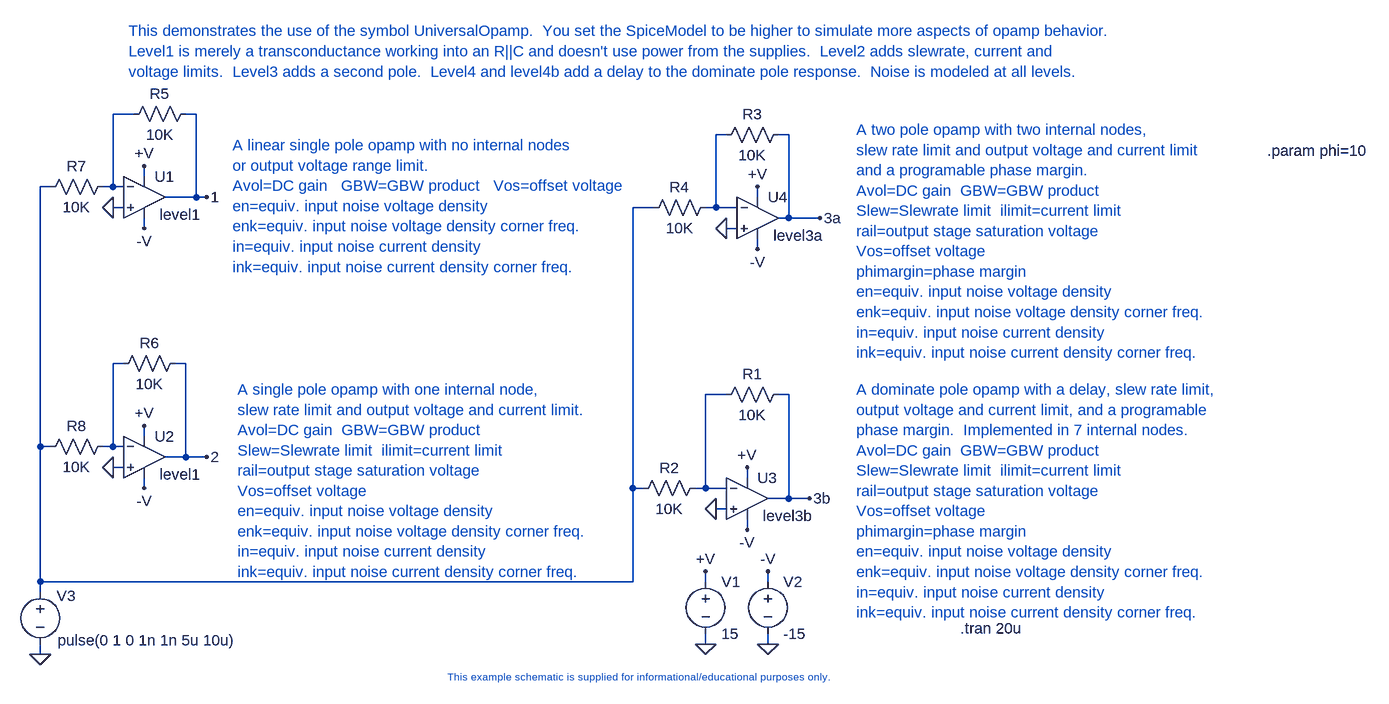
[diagram p0: schematic TimeDomainUniversalOpamp.asc]
TimeDomainUniversalOpamp.asc, the LTspice schematic file:
Version 4
SHEET 1 2580 1112
WIRE 112 -320 80 -320
WIRE 208 -320 192 -320
WIRE 1024 -288 1008 -288
WIRE 1120 -288 1104 -288
WIRE 128 -224 128 -240
WIRE -16 -208 -32 -208
WIRE 80 -208 80 -320
WIRE 80 -208 64 -208
WIRE 96 -208 80 -208
WIRE 208 -192 208 -320
WIRE 208 -192 160 -192
WIRE 224 -192 208 -192
WIRE 1072 -192 1072 -208
WIRE 96 -176 80 -176
WIRE 912 -176 880 -176
WIRE 1008 -176 1008 -288
WIRE 1008 -176 992 -176
WIRE 1040 -176 1008 -176
WIRE 1120 -160 1120 -288
WIRE 1120 -160 1104 -160
WIRE 1168 -160 1120 -160
WIRE 128 -144 128 -160
WIRE 1040 -144 1024 -144
WIRE 1072 -112 1072 -128
WIRE 96 64 80 64
WIRE 192 64 176 64
WIRE 1024 112 992 112
WIRE 1120 112 1104 112
WIRE 128 176 128 160
WIRE -32 192 -32 -208
WIRE -16 192 -32 192
WIRE 80 192 80 64
WIRE 80 192 64 192
WIRE 96 192 80 192
WIRE 192 208 192 64
WIRE 192 208 160 208
WIRE 224 208 192 208
WIRE 96 224 80 224
WIRE 1056 240 1056 224
WIRE 128 256 128 240
WIRE 880 256 880 -176
WIRE 896 256 880 256
WIRE 992 256 992 112
WIRE 992 256 976 256
WIRE 1024 256 992 256
WIRE 1120 272 1120 112
WIRE 1120 272 1088 272
WIRE 1152 272 1120 272
WIRE 1024 288 1008 288
WIRE 1056 320 1056 304
WIRE -32 400 -32 192
WIRE 880 400 880 256
WIRE 880 400 -32 400
WIRE 992 400 992 384
WIRE 1088 400 1088 384
WIRE -32 416 -32 400
WIRE 992 496 992 480
WIRE 1088 496 1088 480
WIRE -32 512 -32 496
FLAG 128 -240 +V
FLAG 128 -144 -V
FLAG 80 -176 0
FLAG 1088 496 0
FLAG 992 496 0
FLAG 992 384 +V
FLAG 1088 384 -V
FLAG -32 512 0
FLAG 128 160 +V
FLAG 128 256 -V
FLAG 80 224 0
FLAG 1056 224 +V
FLAG 1056 320 -V
FLAG 1008 288 0
FLAG 1072 -208 +V
FLAG 1072 -112 -V
FLAG 1024 -144 0
FLAG 224 -192 1
FLAG 224 208 2
FLAG 1152 272 3b
FLAG 1168 -160 3a
SYMBOL voltage 992 384 R0
SYMATTR InstName V1
SYMATTR Value 15
SYMBOL voltage 1088 384 R0
SYMATTR InstName V2
SYMATTR Value -15
SYMBOL voltage -32 400 R0
WINDOW 0 25 22 Left 2
WINDOW 3 27 90 Left 2
SYMATTR InstName V3
SYMATTR Value pulse(0 1 0 1n 1n 5u 10u)
SYMBOL opamps\\UniversalOpamp 128 -192 R0
WINDOW 38 24 27 Left 2
SYMATTR SpiceModel level1
SYMATTR InstName U1
SYMBOL opamps\\UniversalOpamp 128 208 R0
WINDOW 38 24 27 Left 2
SYMATTR InstName U2
SYMATTR SpiceLine ilimit=25m rail=0 Vos=0 phimargin={phi}
SYMBOL opamps\\UniversalOpamp 1056 272 R0
WINDOW 38 24 27 Left 2
SYMATTR SpiceModel level3b
SYMATTR InstName U3
SYMATTR SpiceLine ilimit=25m rail=0 Vos=0 phimargin={phi}
SYMBOL opamps\\UniversalOpamp 1072 -160 R0
WINDOW 38 24 27 Left 2
SYMATTR SpiceModel level3a
SYMATTR InstName U4
SYMATTR SpiceLine ilimit=25m rail=0 Vos=0 phimargin={phi}
SYMBOL res 1120 96 R90
WINDOW 0 0 56 VBottom 2
WINDOW 3 32 56 VTop 2
SYMATTR InstName R1
SYMATTR Value 10K
SYMBOL res 992 240 R90
WINDOW 0 0 56 VBottom 2
WINDOW 3 32 56 VTop 2
SYMATTR InstName R2
SYMATTR Value 10K
SYMBOL res 1120 -304 R90
WINDOW 0 0 56 VBottom 2
WINDOW 3 32 56 VTop 2
SYMATTR InstName R3
SYMATTR Value 10K
SYMBOL res 1008 -192 R90
WINDOW 0 0 56 VBottom 2
WINDOW 3 32 56 VTop 2
SYMATTR InstName R4
SYMATTR Value 10K
SYMBOL res 208 -336 R90
WINDOW 0 0 56 VBottom 2
WINDOW 3 32 56 VTop 2
SYMATTR InstName R5
SYMATTR Value 10K
SYMBOL res 192 48 R90
WINDOW 0 0 56 VBottom 2
WINDOW 3 32 56 VTop 2
SYMATTR InstName R6
SYMATTR Value 10K
SYMBOL res 80 -224 R90
WINDOW 0 0 56 VBottom 2
WINDOW 3 32 56 VTop 2
SYMATTR InstName R7
SYMATTR Value 10K
SYMBOL res 80 176 R90
WINDOW 0 0 56 VBottom 2
WINDOW 3 32 56 VTop 2
SYMATTR InstName R8
SYMATTR Value 10K
TEXT 1384 472 Left 2 !.tran 20u
TEXT 264 -272 Left 2 ;A linear single pole opamp with no internal nodes\nor output voltage range limit.\nAvol=DC gain   GBW=GBW product   Vos=offset voltage\nen=equiv. input noise voltage density\nenk=equiv. input noise voltage density corner freq.\nin=equiv. input noise current density\nink=equiv. input noise current density corner freq.
TEXT 272 104 Left 2 ;A single pole opamp with one internal node,\nslew rate limit and output voltage and current limit.\nAvol=DC gain  GBW=GBW product\nSlew=Slewrate limit  ilimit=current limit\nrail=output stage saturation voltage\nVos=offset voltage\nen=equiv. input noise voltage density\nenk=equiv. input noise voltage density corner freq.\nin=equiv. input noise current density\nink=equiv. input noise current density corner freq.
TEXT 1224 104 Left 2 ;A dominate pole opamp with a delay, slew rate limit,\noutput voltage and current limit, and a programable\nphase margin.  Implemented in 7 internal nodes.\nAvol=DC gain  GBW=GBW product\nSlew=Slewrate limit  ilimit=current limit\nrail=output stage saturation voltage\nVos=offset voltage\nphimargin=phase margin\nen=equiv. input noise voltage density\nenk=equiv. input noise voltage density corner freq.\nin=equiv. input noise current density\nink=equiv. input noise current density corner freq.
TEXT 1224 -296 Left 2 ;A two pole opamp with two internal nodes,\nslew rate limit and output voltage and current limit\nand a programable phase margin.\nAvol=DC gain  GBW=GBW product\nSlew=Slewrate limit  ilimit=current limit\nrail=output stage saturation voltage\nVos=offset voltage\nphimargin=phase margin\nen=equiv. input noise voltage density\nenk=equiv. input noise voltage density corner freq.\nin=equiv. input noise current density\nink=equiv. input noise current density corner freq.
TEXT 880 536 Top 1 ;This example schematic is supplied for informational/educational purposes only.
TEXT 104 -448 Left 2 ;This demonstrates the use of the symbol UniversalOpamp.  You set the SpiceModel to be higher to simulate more aspects of opamp behavior.\nLevel1 is merely a transconductance working into an R||C and doesn't use power from the supplies.  Level2 adds slewrate, current and\nvoltage limits.  Level3 adds a second pole.  Level4 and level4b add a delay to the dominate pole response.  Noise is modeled at all levels.
TEXT 1856 -264 Left 2 !.param phi=10

The netlist it stands for:
* TimeDomainUniversalOpamp.asc
V1 +V 0 15
V2 -V 0 -15
V3 N003 0 pulse(0 1 0 1n 1n 5u 10u)
XU1 0 N001 +V -V 1 level1 Avol=1Meg GBW=10Meg Vos=0 En=0 Enk=0 In=0 Ink=0 Rin=500Meg  ; pins In+ In- V+ V- OUT
XU2 0 N004 +V -V 2 level1 Avol=1Meg GBW=10Meg Vos=0 ilimit=25m rail=0 Vos=0 phimargin={phi}  ; pins In+ In- V+ V- OUT
XU3 0 N005 +V -V 3b level3b Avol=1Meg GBW=10Meg Vos=0 ilimit=25m rail=0 Vos=0 phimargin={phi}  ; pins In+ In- V+ V- OUT
XU4 0 N002 +V -V 3a level3a Avol=1Meg GBW=10Meg Vos=0 ilimit=25m rail=0 Vos=0 phimargin={phi}  ; pins In+ In- V+ V- OUT
R1 3b N005 10K
R2 N005 N003 10K
R3 3a N002 10K
R4 N002 N003 10K
R5 1 N001 10K
R6 2 N004 10K
R7 N001 N003 10K
R8 N004 N003 10K
.tran 20u
* A linear single pole opamp with no internal nodes
* or output voltage range limit.
* Avol=DC gain   GBW=GBW product   Vos=offset voltage
* en=equiv. input noise voltage density
* enk=equiv. input noise voltage density corner freq.
* in=equiv. input noise current density
* ink=equiv. input noise current density corner freq.
* A single pole opamp with one internal node,
* slew rate limit and output voltage and current limit.
* Avol=DC gain  GBW=GBW product
* Slew=Slewrate limit  ilimit=current limit
* rail=output stage saturation voltage
* Vos=offset voltage
* en=equiv. input noise voltage density
* enk=equiv. input noise voltage density corner freq.
* in=equiv. input noise current density
* ink=equiv. input noise current density corner freq.
* A dominate pole opamp with a delay, slew rate limit,
* output voltage and current limit, and a programable
* phase margin.  Implemented in 7 internal nodes.
* Avol=DC gain  GBW=GBW product
* Slew=Slewrate limit  ilimit=current limit
* rail=output stage saturation voltage
* Vos=offset voltage
* phimargin=phase margin
* en=equiv. input noise voltage density
* enk=equiv. input noise voltage density corner freq.
* in=equiv. input noise current density
* ink=equiv. input noise current density corner freq.
* A two pole opamp with two internal nodes,
* slew rate limit and output voltage and current limit
* and a programable phase margin.
* Avol=DC gain  GBW=GBW product
* Slew=Slewrate limit  ilimit=current limit
* rail=output stage saturation voltage
* Vos=offset voltage
* phimargin=phase margin
* en=equiv. input noise voltage density
* enk=equiv. input noise voltage density corner freq.
* in=equiv. input noise current density
* ink=equiv. input noise current density corner freq.
* This example schematic is supplied for informational/educational purposes only.
* This demonstrates the use of the symbol UniversalOpamp.  You set the SpiceModel to be higher to simulate more aspects of opamp behavior.
* Level1 is merely a transconductance working into an R||C and doesn't use power from the supplies.  Level2 adds slewrate, current and
* voltage limits.  Level3 adds a second pole.  Level4 and level4b add a delay to the dominate pole response.  Noise is modeled at all levels.
.param phi=10
.lib UniversalOpAmp1.lib
.backanno
.end